# EAGLE board galvanika-board-2.2 (EAGLE 9.4.2)
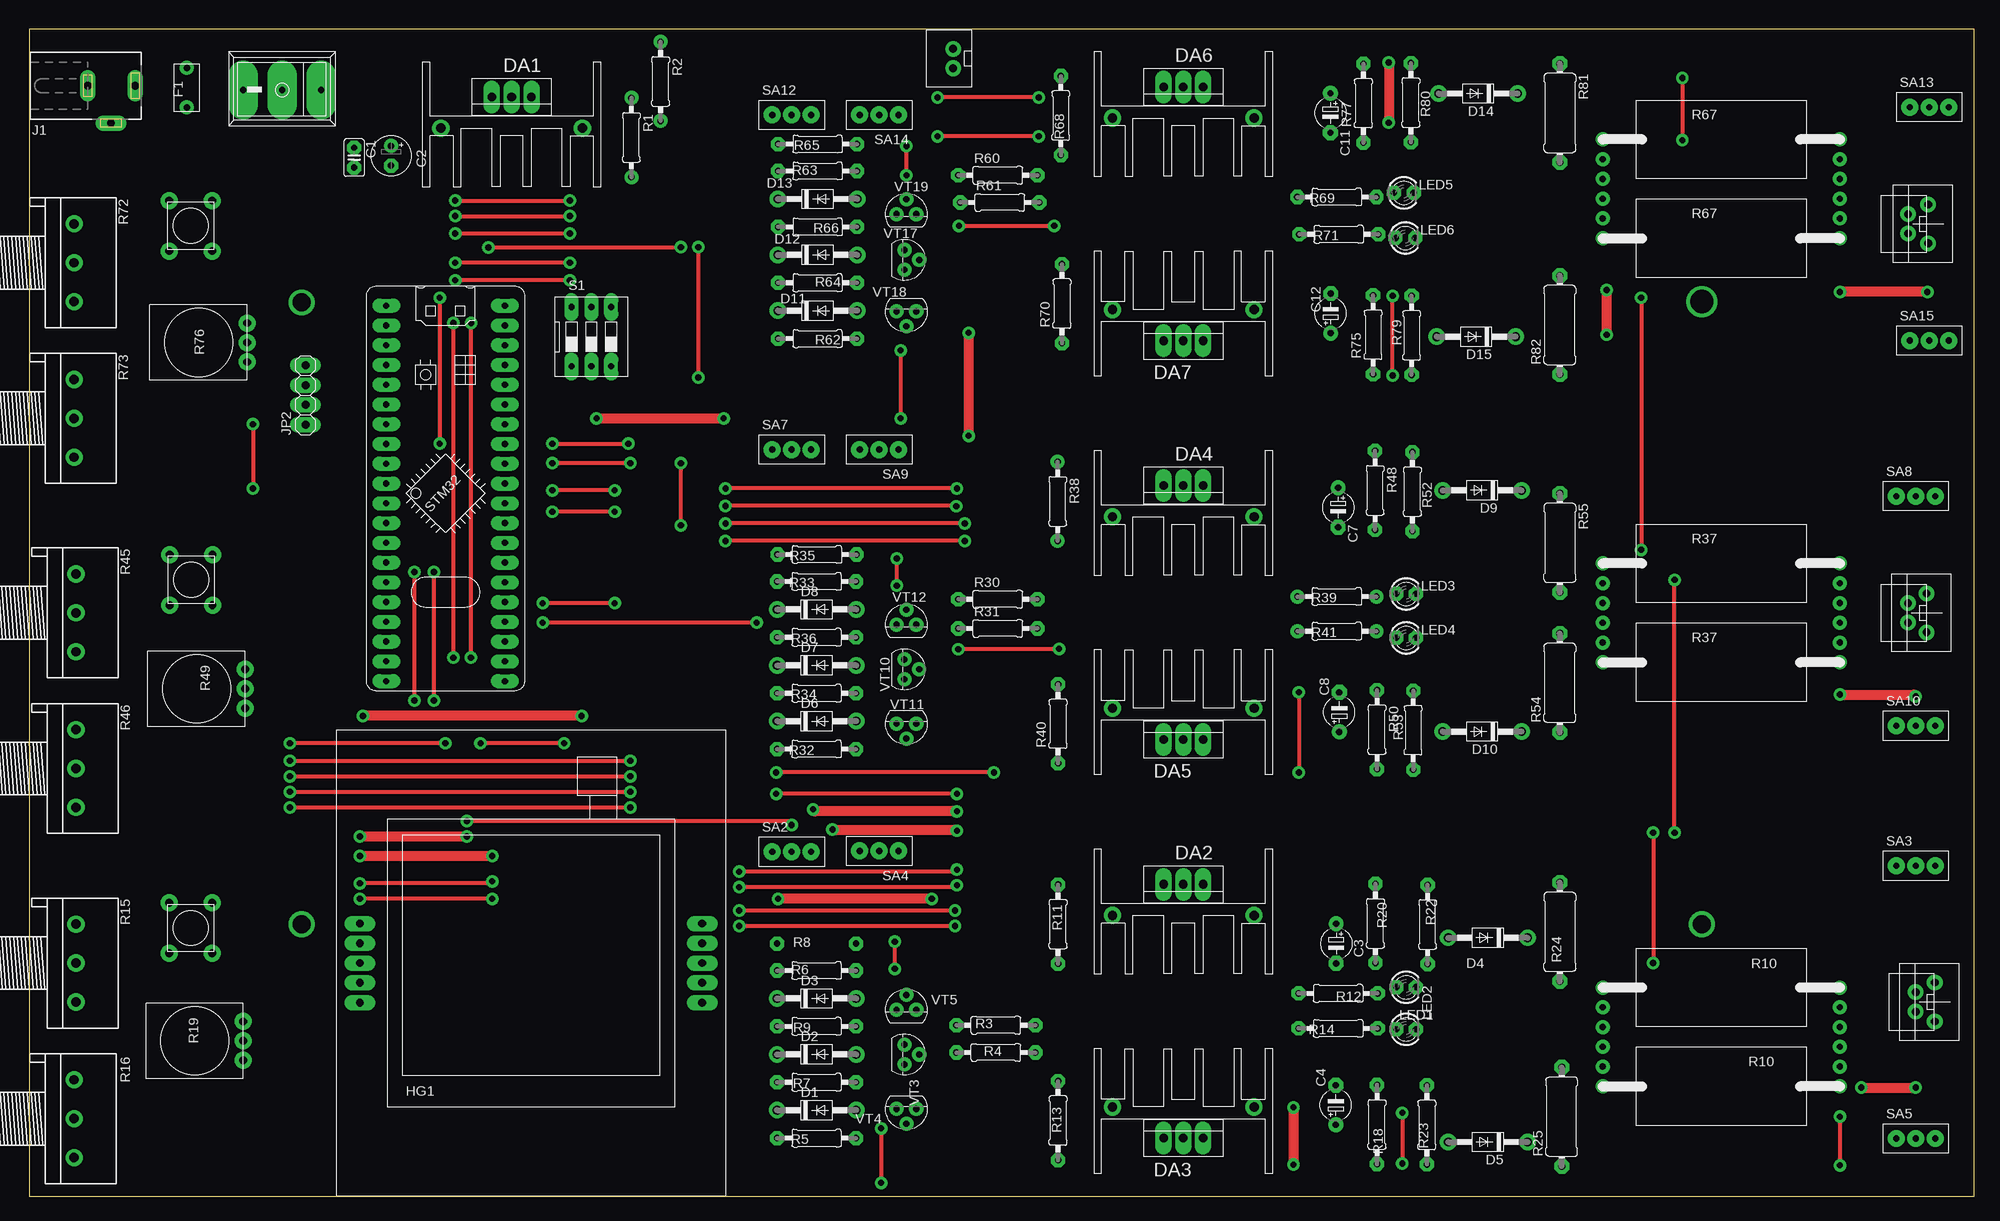
[diagram p2: board, top side]
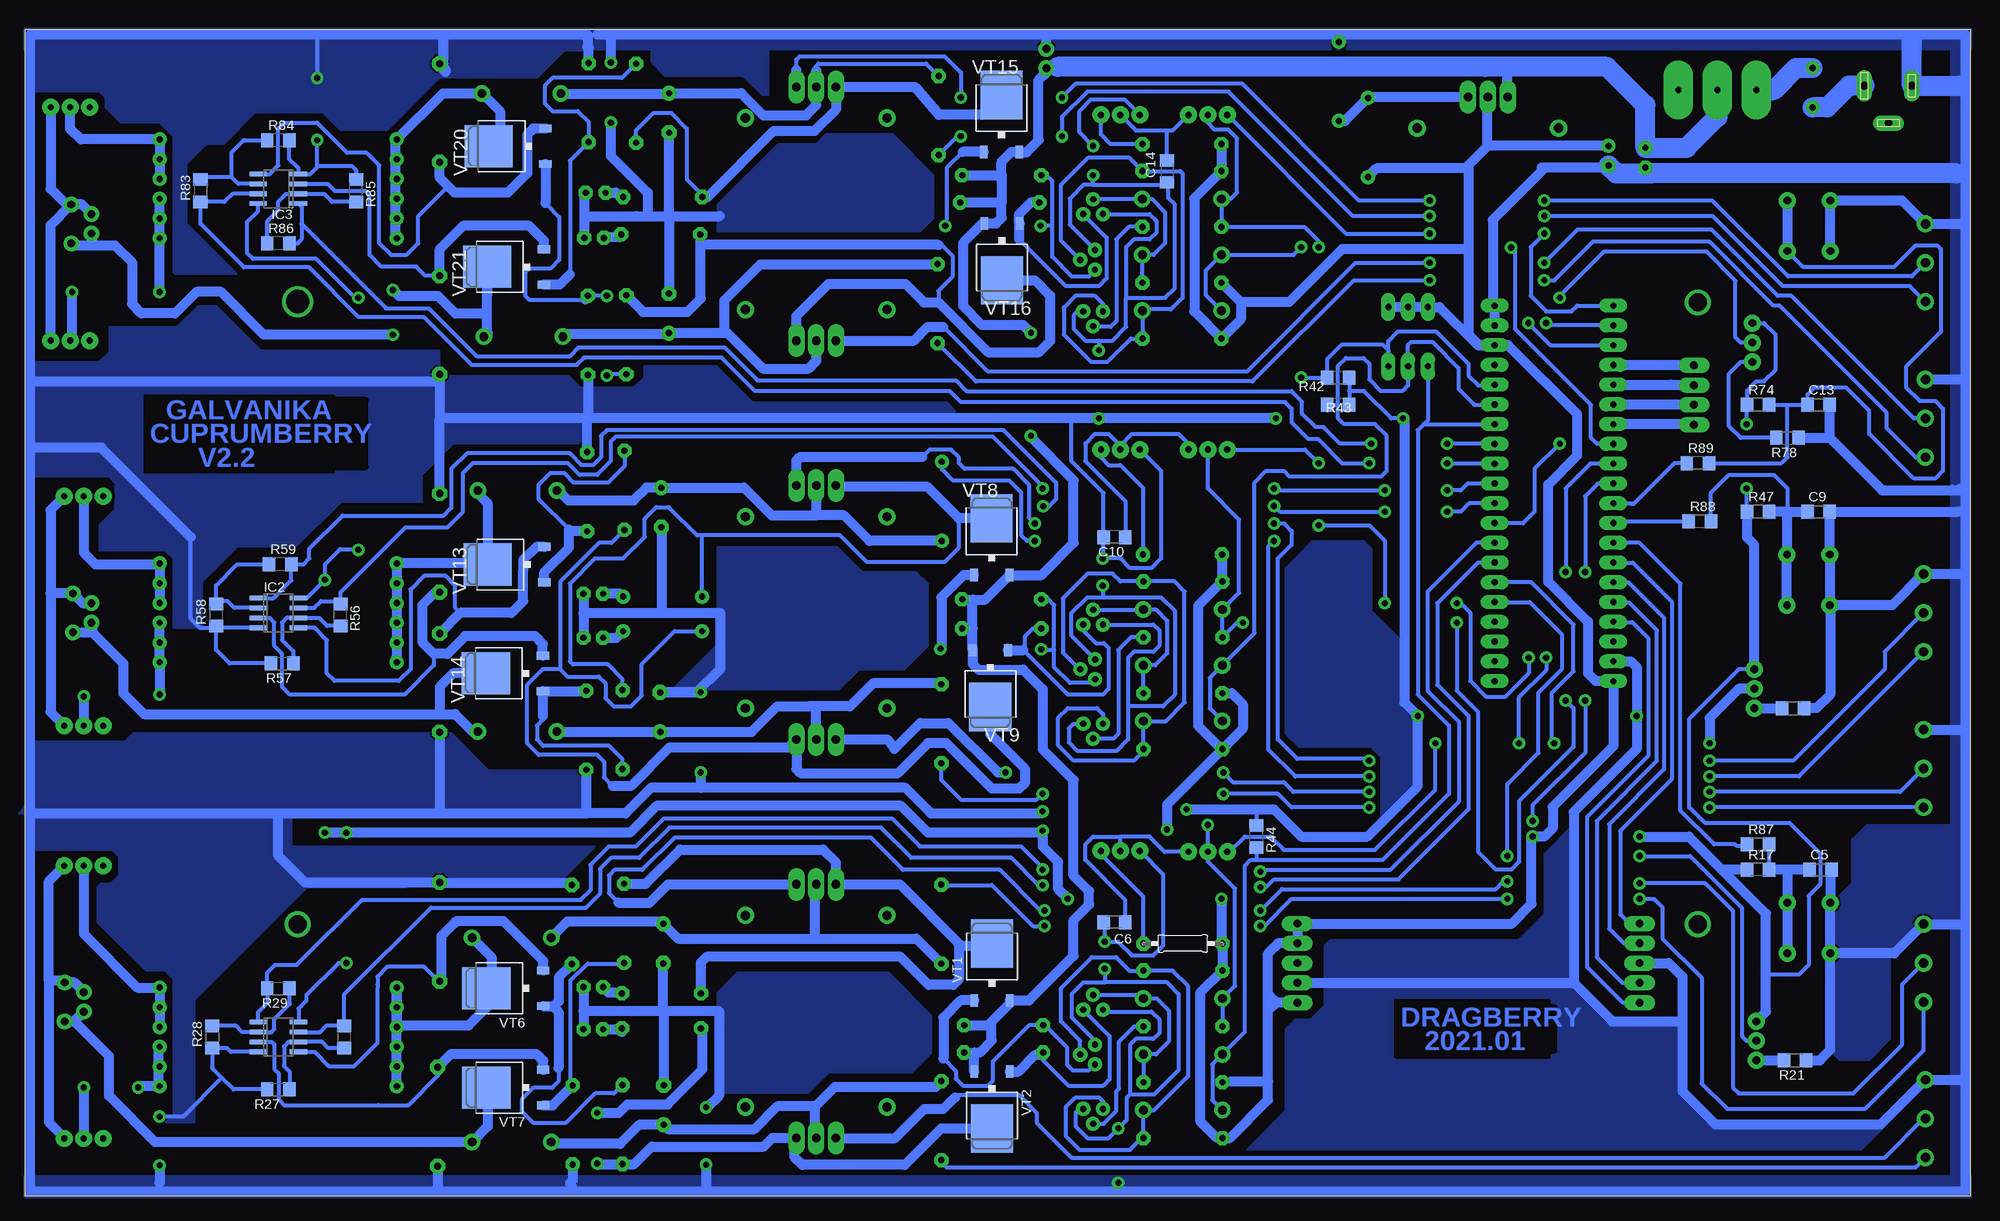
[diagram p3: board, bottom side, seen from below]

Size 250 x 150 mm. Coordinates in mm from the lower left corner, seen from the top.
Outline: 0,0 250,0 250,150 0,150 0,0
Copper layers (1*16): Top 0.035mm / dielectric 1.5mm / Bottom 0.035mm
Design rules "default *": minimum track width 6mil, minimum drill 0.8mm, track to track 15mil, track to pad 6mil, pad to pad 6mil, via to via 6mil, smd to smd 6mil, copper to edge 0mil, drill to drill 6mil, minimum pad ring 0.5mm, minimum via ring 8mil, stop-mask expansion 4mil, vias tented up to drill 0mil, thermal gap 10mil

## Footprints (pad centres in the part's own frame; a part is rotated, then mirrored left to right if it is on the bottom)
C025-025X050 = drill 0.813 octagon: 1 -1.27,0; 2 1.27,0
E2,5-5 = drill 0.813 pad 1.6: + -1.27,0 | drill 0.813 pad 1.6 octagon: - 1.27,0
E5-4 = drill 0.813 pad 1.905: + -2.54,0 | drill 0.813 pad 1.905 octagon: - 2.54,0
C1206 = smd 1.6 x 1.8: 1 -1.4,0; 2 1.4,0
DO41-10 = drill 1.118: A 5.08,0; C -5.08,0
TO220-23X16X40 = drill 1.118 long: 1 -2.54,0; 2 0,0; 3 2.54,0 | drill 1.2: P$1 -9.1,4; P$2 9.1,4
BLUE_PILL = drill 0.8 long: P$1 -7.62,15.24; P$2 -7.62,12.7; P$3 -7.62,10.16; P$4 -7.62,7.62; P$5 -7.62,5.08; P$6 -7.62,2.54; P$7 -7.62,0; P$8 -7.62,-2.54; P$9 -7.62,-5.08; P$10 -7.62,-7.62; P$11 -7.62,-10.16; P$12 -7.62,-12.7; P$13 -7.62,-15.24; P$14 -7.62,-17.78; P$15 -7.62,-20.32; P$16 -7.62,-22.86; P$17 -7.62,-25.4; P$18 -7.62,-27.94; P$19 -7.62,-30.48; P$20 -7.62,-33.02; P$21 7.62,15.24; P$22 7.62,12.7; P$23 7.62,10.16; P$24 7.62,7.62; P$25 7.62,5.08; P$26 7.62,2.54; P$27 7.62,0; P$28 7.62,-2.54; P$29 7.62,-5.08; P$30 7.62,-7.62; P$31 7.62,-10.16; P$32 7.62,-12.7; P$33 7.62,-15.24; P$34 7.62,-17.78; P$35 7.62,-20.32; P$36 7.62,-22.86; P$37 7.62,-25.4; P$38 7.62,-27.94; P$39 7.62,-30.48; P$40 7.62,-33.02
MF-R = drill 0.8 pad 1.676: 1 -2.54,0; 2 2.54,0
WD-G0906WY-BOARD = drill 1.016 pad 1.93 long: P$1 -22,5.08; P$2 -22,2.54; P$3 -22,0; P$4 -22,-2.54; P$5 -22,-5.08; P$6 22,-5.08; P$7 22,-2.54; P$8 22,0; P$9 22,2.54; P$10 22,5.08
SO08 = smd 0.6 x 2.2: 1 -1.905,-2.6; 2 -0.635,-2.6; 3 0.635,-2.6; 4 1.905,-2.6; 5 1.905,2.6; 6 0.635,2.6; 7 -0.635,2.6; 8 -1.905,2.6
DCJ0303 = drill 1 pad 2 long: 1 0,3.1; 2 4.8,0; 3 0,-3
1X04 = drill 1.016 long: 1 -3.81,0; 2 -1.27,0; 3 1.27,0; 4 3.81,0
LED3MM = drill 0.813 octagon: A -1.27,0; K 1.27,0
0207/10 = drill 0.8 pad 1.6: 1 -5.08,0; 2 5.08,0
0207/10' = drill 0.813 octagon: 1 -5.08,0; 2 5.08,0
SQP-5W-2 = drill 0.8 pad 1.778: 1 -15.24,6.35; 2 15.24,6.35; 3 -15.24,-6.35; 4 15.24,-6.35; P$1 -15.24,3.81; P$2 -15.24,1.27; P$3 -15.24,-1.27; P$4 -15.24,-3.81; P$5 15.24,3.81; P$6 15.24,1.27; P$7 15.24,-1.27; P$8 15.24,-3.81
3RP/1610N = drill 1.2 pad 2.184: 1 -5,0; 2 0,0; 3 5,0
R1206 = smd 1.6 x 1.803: 1 -1.422,0; 2 1.422,0
R0904N = drill 1 pad 2.184: 1 -2.5,0; 2 0,0; 3 2.5,0
0411/12 = drill 0.914 octagon: 1 -6.35,0; 2 6.35,0
DS-03 = drill 0.813 long: 1 -2.54,-3.81; 2 0,-3.81; 3 2.54,-3.81; 4 2.54,3.81; 5 0,3.81; 6 -2.54,3.81
KCD11-101-V = drill 0.8 pad 3.81 long: 1 0,0; 2 -5,0; 3 5,0
SS12D00 = drill 0.8 pad 2.184: 1$O -2.5,0; 1$P 0,0; 1$S 2.5,0
KLS7-6X6 = drill 1 pad 2.184: P$1 -3.25,2.75; P$2 3.25,2.75; P$3 -3.25,-2.75; P$4 3.25,-2.75
TO252 = smd 1 x 1.6: 1 -2.28,-4.8; 2 2.28,-4.8 | smd 5.4 x 6.2: 3 0,2.5
TO92 = drill 0.813 pad 1.676: 1 1.27,0; 2 0,1.905; 3 -1.27,0
CWF-2 = drill 1 pad 1.93: P$1 -1.25,0; P$2 1.25,0
KLS2-2 = drill 1 pad 1.778: 1 -2.5,0; 2 2.5,0

## Placement (x,y rotation side)
C1  2.2uF  [C025-025X050]  41.75,133.5 270 top
C2  0.1uF  [E2,5-5]  46.5,133.75 270 top
C3  1uF  [E5-4]  168,32.5 270 top
C4  1uF  [E5-4]  167.95,11.75 90 top
C5  1u  [C1206]  19.25,42 0 bottom
C6  0.1uF  [C1206]  110,35.25 180 bottom
C7  1uF  [E5-4]  168.25,88.55 270 top
C8  1uF  [E5-4]  168.4,62.25 90 top
C9  1u  [C1206]  19.5,88 0 bottom
C10  0.1uF  [C1206]  110,84.75 180 bottom
C11  1uF  [E5-4]  167.25,139.25 270 top
C12  1uF  [E5-4]  167.3,113.5 90 top
C13  1u  [C1206]  19.5,101.75 0 bottom
C14  0.1uF  [C1206]  103.25,131.75 270 bottom
D1  1N4001  [DO41-10]  101.2,11.09 0 top
D2  1N4001  [DO41-10]  101.2,18.27 0 top
D3  1N4001  [DO41-10]  101.2,25.45 0 top
D4  1N4001  [DO41-10]  187.5,33.25 180 top
D5  1N4001  [DO41-10]  187.5,7 180 top
D6  1N4001  [DO41-10]  101.2,61.09 0 top
D7  1N4001  [DO41-10]  101.2,68.27 0 top
D8  1N4001  [DO41-10]  101.2,75.45 0 top
D9  1N4001  [DO41-10]  186.75,90.75 180 top
D10  1N4001  [DO41-10]  186.75,59.75 180 top
D11  1N4001  [DO41-10]  101.33,113.84 0 top
D12  1N4001  [DO41-10]  101.33,121.02 0 top
D13  1N4001  [DO41-10]  101.33,128.2 0 top
D14  1N4001  [DO41-10]  186.25,141.75 180 top
D15  1N4001  [DO41-10]  186,110.5 180 top
DA1  LM338TO-220-23X16X40  [TO220-23X16X40]  62,141.3 180 top
DA2  LM338TO-220-23X16X40  [TO220-23X16X40]  148.35,40.12 180 top
DA3  LM338TO-220-23X16X40  [TO220-23X16X40]  148.35,7.5 0 top
DA4  LM338TO-220-23X16X40  [TO220-23X16X40]  148.35,91.36 180 top
DA5  LM338TO-220-23X16X40  [TO220-23X16X40]  148.35,58.74 0 top
DA6  LM338TO-220-23X16X40  [TO220-23X16X40]  148.35,142.6 180 top
DA7  LM338TO-220-23X16X40  [TO220-23X16X40]  148.35,109.98 0 top
DD1  [BLUE_PILL]  53.5,99.25 0 top
F1  1.85A  [MF-R]  20.25,142.5 90 top
HG1  WD-G0906WY-BOARD  [WD-G0906WY-BOARD]  64.5,30 0 top
IC1  LM358D  [SO08]  217.5,20.5 270 bottom
IC2  LM358D  [SO08]  217.5,75 270 bottom
IC3  LM358D  [SO08]  217.5,129.5 90 bottom
J1  [DCJ0303]  10.5,142.75 270 top
JP2  [1X04]  35.5,103 90 top
LED1  [LED3MM]  177,26.9 0 top
LED2  [LED3MM]  177,21.5 0 top
LED3  [LED3MM]  177,77.45 0 top
LED4  [LED3MM]  177,71.8 0 top
LED5  [LED3MM]  176.7,129 0 top
LED6  [LED3MM]  176.9,123.2 0 top
R1  [0207/10]  77.4,136.1 270 top
R2  [0207/10]  81.15,143.3 270 top
R3  3.3K  [0207/10']  124.25,22 0 top
R4  3.3K  [0207/10']  124.25,18.5 0 top
R5  680k  [0207/10']  101.2,7.5 180 top
R6  680K  [0207/10']  101.2,29.04 180 top
R7  680k  [0207/10']  101.2,14.68 180 top
R8  10K  [0207/10']  101.2,32.5 0 bottom
R9  10k  [0207/10']  101.2,21.86 180 top
R10  [SQP-5W-2]  217.5,20.5 0 top
R11  240  [0207/10']  132.25,35 270 top
R12  [0207/10']  168.25,26.1 180 top
R13  240  [0207/10']  132.25,9.75 90 top
R14  [0207/10']  168.25,21.6 180 top
R15  2k  [3RP/1610N]  6,30 270 top
R16  2k  [3RP/1610N]  5.75,10 270 top
R17  4.7k  [R1206]  27.25,42 0 bottom
R18  330  [0207/10']  173.25,9.25 270 top
R19  [R0904N]  27.5,20 90 top
R20  330  [0207/10']  173.05,35.1 270 top
R21  100  [R1206]  22.5,17.5 180 bottom
R22  3.3k  [0207/10']  179.75,34.95 270 top
R23  3.3k  [0207/10']  179.65,9.2 90 top
R24  0.1  [0411/12]  196.75,34 270 top
R25  0.1  [0411/12]  197,10.25 90 top
R26  100K  [R1206]  209,20.5 270 bottom
R27  10K  [R1206]  217.5,13.75 180 bottom
R28  10K  [R1206]  226,20.5 90 bottom
R29  100K  [R1206]  217.5,26.75 180 bottom
R30  3.3k  [0207/10']  124.5,76.75 0 top
R31  3.3k  [0207/10']  124.5,73 0 top
R32  680k  [0207/10']  101.2,57.5 180 top
R33  680K  [0207/10']  101.2,79.04 180 top
R34  680k  [0207/10']  101.2,64.68 180 top
R35  10K  [0207/10']  101.25,82.5 180 top
R36  10k  [0207/10']  101.2,71.86 180 top
R37  [SQP-5W-2]  217.5,75 0 top
R38  240  [0207/10]  132.2,89.33 270 top
R39  [0207/10]  168.08,77.1 180 top
R40  240  [0207/10']  132.25,60.75 90 top
R41  [0207/10]  168.08,72.65 180 top
R42  1k  [R1206]  81.25,105.25 180 bottom
R43  1k  [R1206]  81.25,101.75 180 bottom
R44  1k  [R1206]  91.75,46.25 270 bottom
R45  2k  [3RP/1610N]  6,75 270 top
R46  2k  [3RP/1610N]  6,55 270 top
R47  4.7k  [R1206]  27.25,88 0 bottom
R48  330  [0207/10']  173,90.75 270 top
R49  [R0904N]  27.75,65.25 90 top
R50  330  [0207/10']  173.25,60 270 top
R51  100  [R1206]  22.75,62.75 180 bottom
R52  3.3k  [0207/10']  177.8,90.58 270 top
R53  3.3k  [0207/10']  177.9,59.92 90 top
R54  0.1  [0411/12]  196.75,66 90 top
R55  0.1  [0411/12]  196.75,84 270 top
R56  100K  [R1206]  209.5,74.75 270 bottom
R57  10K  [R1206]  217,68.5 180 bottom
R58  10K  [R1206]  225.5,74.75 90 bottom
R59  100K  [R1206]  217.25,81.25 0 bottom
R60  3.3k  [0207/10']  124.5,131.25 0 top
R61  3.3k  [0207/10']  124.75,127.75 0 top
R62  680k  [0207/10']  101.33,110.25 180 top
R63  680K  [0207/10']  101.33,131.79 180 top
R64  680k  [0207/10']  101.33,117.43 180 top
R65  10K  [0207/10']  101.33,135.25 180 top
R66  10k  [0207/10']  101.33,124.61 180 top
R67  [SQP-5W-2]  217.5,129.5 0 top
R68  240  [0207/10']  132.6,138.92 90 top
R69  [0207/10']  168.08,128.45 180 top
R70  240  [0207/10']  132.75,114.75 90 top
R71  [0207/10']  168.33,123.65 180 top
R72  2k  [3RP/1610N]  5.75,120 270 top
R73  2k  [3RP/1610N]  5.75,100 270 top
R74  4.7k  [R1206]  27.25,101.75 0 bottom
R75  330  [0207/10']  172.75,110.75 90 top
R76  [R0904N]  28,109.75 90 top
R77  330  [0207/10']  171.5,140.5 90 top
R78  100  [R1206]  23.5,97.5 180 bottom
R79  3.3k  [0207/10']  177.7,110.67 90 top
R80  51k  [0207/10']  177.6,140.58 270 top
R81  0.1  [0411/12]  196.75,139.25 270 top
R82  3.3k  [0411/12]  196.75,112 90 top
R83  100K  [R1206]  227.5,129.25 90 bottom
R84  10K  [R1206]  217.5,135.75 0 bottom
R85  10K  [R1206]  207.5,129.25 270 bottom
R86  100K  [R1206]  217.5,122.5 0 bottom
R87  510  [R1206]  27.25,45.25 0 bottom
R88  510  [R1206]  34.75,86.75 0 bottom
R89  510  [R1206]  35,94.25 0 bottom
S1  [DS-03]  72.25,110.5 0 top
SA1  KCD11-101V  [KCD11-101-V]  32.5,142.2 180 top
SA2  [SS12D00]  98,44.3 0 top
SA3  [SS12D00]  242.5,42.5 0 top
SA4  [SS12D00]  109.25,44.4 180 top
SA5  [SS12D00]  242.5,7.45 0 top
SA6  KLS7-6X6  [KLS7-6X6]  20.75,34.5 270 top
SA7  [SS12D00]  98,96 0 top
SA8  [SS12D00]  242.5,90 0 top
SA9  [SS12D00]  109.25,96 180 top
SA10  [SS12D00]  242.5,60.5 0 top
SA11  KLS7-6X6  [KLS7-6X6]  20.8,79.25 270 top
SA12  [SS12D00]  98,139 0 top
SA13  [SS12D00]  244.25,140 0 top
SA14  [SS12D00]  109.25,139 180 top
SA15  [SS12D00]  244.25,110 0 top
SA16  KLS7-6X6  [KLS7-6X6]  20.75,124.75 270 top
VT1  AOD403  [TO252]  125.75,30 0 bottom
VT2  AOD403  [TO252]  125.75,11.25 180 bottom
VT3  2N2222  [TO92]  112.5,18.25 270 top
VT4  2N2222  [TO92]  112.75,11.25 180 top
VT5  2N2222  [TO92]  112.75,24 0 top
VT6  LR2905  [TO252]  188.25,26.75 90 bottom
VT7  LR2905  [TO252]  188.25,14 90 bottom
VT8  AOD403  [TO252]  125.78,84.65 0 bottom
VT9  AOD403  [TO252]  125.97,65.4 180 bottom
VT10  2N2222  [TO92]  112.48,67.75 270 top
VT11  2N2222  [TO92]  112.75,60.75 180 top
VT12  2N2222  [TO92]  112.75,73.5 0 top
VT13  LR2905  [TO252]  188.1,81.22 90 bottom
VT14  LR2905  [TO252]  188.3,67.22 90 bottom
VT15  AOD403  [TO252]  124.53,139.05 0 bottom
VT16  AOD403  [TO252]  124.47,120.25 180 bottom
VT17  2N2222  [TO92]  112.5,120.37 270 top
VT18  2N2222  [TO92]  112.75,113.75 180 top
VT19  2N2222  [TO92]  112.75,126.25 0 top
VT20  LR2905  [TO252]  187.95,134.97 90 bottom
VT21  LR2905  [TO252]  188.15,119.47 90 bottom
XS1  CWF-2  [CWF-2]  242.5,25 90 top
XS2  KLS2-2  [KLS2-2]  244.95,25 90 top
XS3  CWF-2  [CWF-2]  241.5,75 90 top
XS4  KLS2-2  [KLS2-2]  243.9,75 90 top
XS5  CWF-2  [CWF-2]  241.5,125 90 top
XS6  KLS2-2  [KLS2-2]  244.1,125 90 top
XS7  CWF-2  [CWF-2]  118.75,146.25 90 top

## Tracks (layer width: path | path; a pad name or v marks a point on that pad's centre or on a via)
+12V  (via drill 0.8 pad 1.6)
  Top 1.27: v120.75,111 v120.75,97.75
  Bottom 0.508: 127.31,18.5 R4.2
  Bottom 1.27: 125.78,22.47 126.25,22 R3.2 | 125.78,22.47 123.47,24.78 VT1.2 120.97,25.2 115.25,30.92 115.25,35.5 113.25,37.5 113.25,39.25 115.25,41.25 115.25,53.5 119.25,57.5 119.25,65.2 121.75,67.7 127.5,67.7 128.25,68.45 VT9.2 | VT2.2 128.03,18.5 | 125.78,22.47 125.78,20.03 127.31,18.5 | R4.2 128.03,18.5 | DA1.3 59.56,145.59 59.48,145.66 62.38,145.18 | 128.25,76.72 126.63,76.72 VT8.2 119.4,79.85 115.25,84 115.25,92.05 120.75,97.55 v120.75,97.75 | R31.2 129.55,72.97 128.25,72.97 | 129.33,76.5 R30.2 129.55,76.72 128.25,76.72 | 128.25,72.97 128.25,76.72 | 128.03,18.5 127.5,18.5 | VT9.2 128.25,70.45 | 117.32,145.18 118.07,145.18 118.75,144.5 | 124.5,131.25 124.5,133 123.25,134.25 VT15.2 122.2,134.2 121.3,134.2 119.75,135.75 119.75,143.5 118.75,144.5 | 124.5,131.25 124.5,127.75 | 124.5,127.75 124.5,125.75 125.2,125.05 VT16.2 126.95,125.05 129.45,122.55 129.45,114.45 127,112 121.75,112 v120.75,111 | R61.2 124.5,127.75 | R60.2 124.5,131.25 | VT9.2 128.25,72.97 | XS7.P$1 118.75,144.5
  Bottom 2.54: 117.32,145.18 62.38,145.18 46.68,145.18 41.75,140.25 C1.1 36.48,134.77 32.5,138.75 SA1.1
A-LEFT
  Bottom 0.508: R25.2 197,15.5 200.75,11.75 204.62,11.75 216.75,11.75 217.47,12.47 217.47,15.82 218,16.35 218,19.5 218.37,19.86 IC1.3
  Bottom 1.27: VT7.2 183.45,17.45 184.25,18.25 195.35,18.25 R25.2
A-LEFT1
  Bottom 0.508: 197.5,69.75 197.5,68.25 201.25,64.5 216,64.5 217,65.5 217,69.75 218,70.75 218,73.75 218.62,74.36 IC2.3
  Bottom 1.27: R55.2 197.35,77.65 199,76 199,71.25 197.5,69.75 195.75,69.75 193.5,72 184.5,72 183.5,71 VT14.2
A-LEFT2
  Bottom 0.508: IC3.3 211.13,130.13 210.24,129.25 206.25,129.25 205.75,128.75 205.75,121 204.25,119.5 199.75,119.5 198.6,118.35 R82.2
  Bottom 1.27: VT21.2 183.35,122.85 185.25,124.75 193.75,124.75 196.75,121.75 R82.2
A-RIGHT
  Bottom 0.508: R24.2 196.9,27.65 198.75,29.5 203.5,29.5 204.75,28.25 204.75,27.25 204.75,26.75 204.75,19.75 207.75,16.75 211,16.75 212.84,18.59 IC1.5
  Bottom 1.27: VT6.2 183.45,30.28 188.59,35.41 194.55,35.41 194.85,35.11 194.89,35.11 196.5,33.5 196.5,27.9 R24.2
A-RIGHT1
  Bottom 0.508: 186,80.5 186,80.75 | 194.1,75 194.75,75.65 194.75,78.5 196,79.75 198.75,79.75 200.5,78 200.5,67.75 202,66.25 210.25,66.25 211.25,67.25 211.25,71.5 212.84,73.09 IC2.5
  Bottom 1.27: VT13.2 184.3,83.5 186,81.8 186,80.75 | R54.2 194.1,75 187.5,75 186,76.5 186,80.5
A-RIGHT2
  Bottom 0.508: IC3.5 218.59,131.41 217.5,132.5 217.5,137.25 216.75,138 212.5,138 208.62,134.12 206.12,134.12 204.5,132.5 204.5,122.5 203,121 201,121 199.5,122.5 199.5,126 195.8,129.7 195.55,129.7
  Bottom 1.27: VT20.2 184.75,137.25 185.5,136.5 185.5,131.5 188,129 194.85,129 195.55,129.7 196.75,130.9 R81.2
ADC0  (via drill 0.8 pad 1.6)
  Top 1.27: v59.5,43.75 v42.5,43.75
  Bottom 0.508: DD1.P$36 56.62,76.39 52.5,72.27 52.5,67.75 55.5,64.75 55.5,57 59.5,53 v59.5,43.75 | v42.5,43.75 36,43.75 29.35,37.1 29.35,20.6 28.75,20 R19.2
ADC1  (via drill 0.8 pad 1.6)
  Top 0.508: v53.5,58.25 v33.5,58.25
  Bottom 0.508: v53.5,58.25 53.75,58.5 53.75,64.75 51,67.5 51,73.5 56.43,78.93 DD1.P$35
  Bottom 1.27: R49.2 29.75,65.25 33.5,61.5 v33.5,58.25
ADC2  (via drill 0.8 pad 1.6)
  Top 0.508: v119.25,40 119,39.75 v91.25,39.75
  Bottom 0.508: v119.25,40 119.75,40 123.27,43.52 136.1,43.52 139.98,47.4 167.22,47.4 171.1,43.52 174.73,43.52 176.15,42.1 176.15,38.9 177.93,37.13 197.87,37.13 209,26 R26.1 209.08,22 211.25,22 212.12,21.14 IC1.7 | v91.25,39.75 90.5,39.75 89.5,40.75 73.5,40.75 64.5,49.75 64.5,61.75 68.5,65.75 68.5,76.25 63.25,81.5 61.15,81.5 DD1.P$34
ADC3  (via drill 0.8 pad 1.6)
  Top 0.508: v119.25,42 119,41.75 v91.25,41.75
  Bottom 0.508: v119.25,42 119.25,42.25 122,45 135,45 138.6,48.6 167.9,48.6 171.5,45 175,45 177.38,42.62 177.38,39.38 178.62,38.12 206.72,38.12 215.1,29.75 217.92,29.75 218.92,28.75 R29.2 218.92,24.83 220.1,23.66 IC1.1 | v91.25,41.75 91,42 74.5,42 65.75,50.75 65.75,61 69.75,65 69.75,77.75 63.49,84.01 DD1.P$33
ADC4  (via drill 0.8 pad 1.6)
  Top 0.508: v52.75,115.5 v52.75,96.75
  Bottom 0.508: v52.75,115.5 52.75,115.75 47.05,121.45 33.95,121.45 30.18,117.67 30.18,110.42 29.5,109.75 R76.2 | v52.75,96.75 56,93.5 56,88 57.5,86.5 61.07,86.5 DD1.P$32
ADC5  (via drill 0.8 pad 1.6)
  Top 0.508: v75.25,88 v67.25,88 | v119.16,88.71 119.12,88.75 v89.5,88.75
  Bottom 0.508: DD1.P$31 64.41,89.09 65.5,88 v67.25,88 | IC2.1 218.09,76.91 215.83,79.17 R59.2 214.25,81.25 213.5,82 213.5,83.25 209.25,87.5 196.25,87.5 195.25,88.5 195.25,93.5 193.25,95.5 180,95.5 178.5,94 177,94 176,95 176,97.75 175.25,98.5 124.25,98.5 117.5,91.75 117.5,89.62 118.41,88.71 v119.16,88.71 | v89.5,88.75 88.75,88 v75.25,88
ADC6  (via drill 0.8 pad 1.6)
  Top 0.508: v75.25,90.75 v67.25,90.75 | v119.25,91 v89.5,91
  Bottom 0.508: DD1.P$30 64.62,91.63 65.5,90.75 v67.25,90.75 | IC2.7 212.87,75.64 212,76.5 209.83,76.5 R56.1 209.5,77.65 201.15,86 195.75,86 193.75,88 193.75,93 192.5,94.25 180.25,94.25 178.75,92.75 176.5,92.75 174.75,94.5 174.75,97 174.14,97.61 125.61,97.61 119.25,91.25 v119.25,91 | v89.5,91 89.25,90.75 v75.25,90.75
ADC7  (via drill 0.8 pad 1.6)
  Top 0.508: v77.25,94.25 v67.25,94.25
  Bottom 0.508: DD1.P$29 61.2,94.25 v67.25,94.25 | v77.25,94.25 80.75,94.25 83.88,97.38 85.12,97.38 87.25,99.5 87.25,101.25 88.09,102.09 129.75,102.09 131.16,103.5 156.2,103.5 160.5,107.8 178.2,107.8 179.13,106.87 192.63,106.87 198.76,113 207.15,113 213.55,119.4 221.9,119.4 227.5,125 R83.1 224.42,127.83 223.38,128.87 IC3.7
ADC8  (via drill 0.8 pad 1.6)
  Top 0.508: v67.25,96.75 v77,96.75
  Bottom 0.508: DD1.P$28 67.21,96.71 v67.25,96.75 | v77,96.75 81,96.75 83.12,98.88 84.12,98.88 85.88,100.62 85.88,102.12 87.25,103.5 129,103.5 130.4,104.9 155.9,104.9 160.05,109.05 178.95,109.05 180,108 192,108 198.14,114.14 203.64,114.14 214.5,125 | R86.2 215,122.5 214.5,123 214.5,125 | 214.5,125 214.5,127.19 IC3.1
BRANCH-CTRL-A  (via drill 0.8 pad 1.6)
  Top 0.508: v49.5,80.25 v49.5,63.75 | v98,47.75 97.5,48.25 v56.25,48.25
  Bottom 0.508: R9.2 D3.C 94.5,27.07 94.5,39.55 98,43.05 SA2.1$P v98,47.75 | DD1.P$10 47.87,91.63 49.5,90 v49.5,80.25 | v56.25,48.25 56.25,50.25 49.5,57 v49.5,63.75
BRANCH-CTRL-B  (via drill 0.8 pad 1.6)
  Top 0.508: v52,80.25 v52,63.75 | v93.5,73.75 v66,73.75
  Bottom 0.508: SA7.1$P 98,91 94,87 94,77.57 D8.C R36.2 94.23,73.75 v93.5,73.75 | DD1.P$9 48.83,94.17 52,91 v52,80.25 | v52,63.75 51,62.75 51,57.79 58,50.79 58,43 59,42 61,42 63.25,44.25 63.25,62.25 66,65 v66,73.75
BRANCH-CTRL-C  (via drill 0.8 pad 1.6)
  Top 0.508: v83.75,122 83.71,121.96 v59,121.96
  Bottom 0.508: SA12.1$P 98,138 97.12,137.12 95.38,137.12 94.25,136 94.25,129 95.05,128.2 D13.C R66.2 85.61,124.61 83.75,122.75 v83.75,122 | v59,121.96 58.5,121.46 58.5,111.5 48.75,101.75 48.75,97.5 47.96,96.71 DD1.P$8
GND  (via drill 0.8 pad 1.6)
  Top 0.508: v232.75,10.25 v232.75,4 | v111.25,32.75 v111.25,29.25 | v109.5,8.75 v109.5,1.75 | v111.5,82 v111.5,78.5 | v163.2,64.8 v163.2,54.5 | v112,108.75 v112,100 | v112.75,131.25 v112.75,135 | v212.5,143.75 v212.5,135.75
  Top 1.27: v119.25,49.5 101,49.5 v100.75,49.75 | v71,61.75 v42.88,61.75 | v72.91,100 v89.25,100 | v174.75,145.75 v174.75,138 | v162.5,11.45 v162.5,4.08
  Bottom 0.508: VT3.3 112.5,20.02 115.5,23.02 115.5,26 114,27.5 111.25,27.5 | 111.25,27.5 103.25,27.5 101.75,26 101.75,16.25 104.88,13.12 108,13.12 | 108,13.12 108.02,13.12 108.44,12.7 108.44,9.8 v109.5,8.75 110.75,7.5 113.5,7.5 115,9 115,10.77 114.52,11.25 VT4.3 | VT5.3 111.23,23.75 105.25,23.75 104.25,22.75 104.25,21 105,20.25 107.25,20.25 108,19.5 108,13.12 | 1,15 0.64,15 | 179.75,1.25 179.75,1 | 179.75,1 179.75,0.64 | v232.75,10.25 229.75,10.25 224.75,15.25 | 232.75,1.75 232.75,0.64 | SA4.1$S 103.75,41.4 103.75,32.25 105,31 107.77,31 109.52,32.75 v111.25,32.75 111.25,35.1 C6.2 | v111.25,29.25 111.25,27.5 | 180,1.75 180,1.25 179.75,1 | 2.25,91.25 2,91 1.25,91 0.64,91 | 1.5,88 0.89,88 0.64,87.75 | 91.75,49.75 R44.1 | VT12.3 105,73.5 104.25,72.75 104.25,70.75 105,70 107.5,70 108.25,69.25 108.25,63 | 108.25,63 108.25,58.75 109.75,57.25 114.75,57.25 115.88,58.38 115.88,60.15 115.27,60.75 VT11.3 | VT10.3 115.5,72.04 115.5,75 113.5,77 111.5,77 | 108.25,63 103.75,63 102.25,64.5 102.25,75.25 104,77 111.5,77 | v111.5,78.5 111.5,77 | SA9.1$S 104,93.25 104,82 105.25,80.75 108,80.75 109.25,82 v111.5,82 111.5,84.65 C10.2 111.4,90.4 115.5,94.5 115.5,100 | 228.75,84.75 228.75,74.25 227.59,73.09 225.73,73.09 | R57.2 223.75,68.5 225.5,70.25 225.5,73.09 225.27,73.09 | IC2.4 225.27,73.09 | 225.27,73.09 R58.1 225.73,73.09 | 225.73,73.09 225.52,73.09 | R42.1 79.83,103.5 | 79.83,103.5 R43.1 | v72.91,100 74.41,100 77.91,103.5 79.83,103.5 | VT18.3 114.75,113.75 115.25,113.25 115.25,111.5 113.75,110 112,110 | 112,110 110.25,110 108.5,111.75 108.5,115.5 | 108.5,115.5 103.5,115.5 102.25,116.75 102.25,127.5 103.12,128.38 103.12,130.22 C14.2 103.6,130 112.75,130
  Bottom 0.508: 112.75,130 114,130 115.75,128.25 115.75,124.89 VT17.3 | VT19.3 105.5,126.25 104.62,125.38 104.62,123.88 105.5,123 107.5,123 108.5,122 108.5,115.5 | 112,110 v112,108.75 | 112.75,130 v112.75,131.25 | v112.75,135 114.5,136.75 114.5,139.5 113,141 108.75,141 SA14.1$S | 173.5,126 171.48,126 | 212.4,132.41 213.4,131.41 IC3.4 214.9,132.15 216.08,133.33 R84.2 | 212.4,132.41 208,132.41 207.5,131.91 R85.1 | 212.4,132.41 212.5,132.5 v212.5,135.75 | 212.5,149.37 v212.5,143.75 | 224.75,15.25 226,16.5 R28.1 224.08,19.08 223.59,18.59 IC1.4 | R27.2 223.25,13.75 224.75,15.25
  Bottom 1.27: 109.5,0.64 0.64,0.64 0.64,15 0.64,35 | 109.5,0.64 162.5,0.64 | 162.5,0.64 179.75,0.64 197,0.64 | 197,0.64 232.75,0.64 249.37,0.64 | 249.37,0.64 249.5,0.64 | 249.37,0.64 249.37,49.25 | 249.37,49.25 249.37,96.25 | 249.37,96.25 249.37,104.75 | 249.37,104.75 249.37,149.37 212.5,149.37 196.25,149.37 | 196.25,149.37 177.75,149.37 177.75,147.76 177.6,147.61 R80.1 | 176.5,149.37 174.75,149.37 | 174.75,149.37 118.75,149.37 | 118.75,149.37 0.64,149.37 0.64,142.75 | 0.64,142.75 0.64,131.48 | 0.64,125 0.64,105 | 0.64,105 0.64,91 0.64,87.75 0.64,80.25 | 0.64,80.25 0.64,60 | 0.64,60 0.64,35 | 1.25,142.75 0.64,142.75 | 178.25,23.85 168,23.85 | HG1.P$3 38.75,30 37,28.25 37,22.5 | HG1.P$7 50.96,27.46 | 50.96,27.46 46,22.5 37,22.5 | DD1.P$19 43.63,68.77 42.88,68.02 v42.88,61.75 42.88,57.52 50.96,49.44 50.96,27.46 | R25.1 197,0.64 | 1,15 R16.1 11.5,9.25 32.75,9.25 37,13.5 37,22.5 | 0.64,35 R15.1 9.75,31.25 SA6.P$4 | 179.85,1.35 179.75,1.25 | SA11.P$4 SA11.P$3 18.1,82.55 C9.2 1.5,88 | SA16.P$4 SA16.P$3 8.75,128 R72.1 0.64,125 | v109.5,1.75 109.5,0.64 | 249.37,49.25 217.5,49.25 | 217.5,49.25 196.75,49.25 | 196.75,49.25 177.9,49.25 | SA6.P$4 SA6.P$3 18,41.85 C5.2 | R21.1 19.33,17.5 18,18.83 SA6.P$4 | SA11.P$4 10,76 R45.1 0.89,80 0.64,80.25 | SA11.P$4 18,75.95 18,64.5 19.75,62.75 R51.1 | R73.1 0.64,105 | DD1.P$22 DD1.P$21 61.37,114.74 61.37,125.5 54.87,132 55.1,132.23 47.5,132.23 47.25,132.48 C2.- | 41,131.48 C1.2 42.25,131.73 | 0.64,131.48 1.75,131.48 | v100.75,49.75 91.75,49.75 89.5,49.75 86,46.25 77.5,46.25 71,52.75 v71,61.75 72.75,63.5 72.75,99.84 v72.91,100 | R46.1 0.64,60 | LED3.K 178.27,74.96 178.23,75 | 178.23,75 178.27,74.95 LED4.K
  Bottom 1.27: 178.23,75 168.25,75 | 168.25,75 160.7,75 160.7,67.79 163.7,64.79 C8.- v163.21,64.79 v163.2,64.8 | 249.37,104.75 196.75,104.75 196.75,100 | R54.1 196.75,49.25 | R55.1 196.75,100 | v89.25,100 v112,100 115.5,100 177.7,100 R79.1 | R53.1 177.9,49.25 | R52.1 177.8,100 196.75,100 | v119.25,49.5 119.5,49.25 133.6,49.25 136.85,52.5 163.2,52.5 | v163.2,54.5 163.2,52.5 | LED6.K 178.17,128.8 LED5.K | 167.25,126 C11.- | 177.83,126 171.48,126 170,126 | 170,126 167.25,126 | 174.75,149.37 v174.75,145.75 | 249.37,96.25 240.25,96.25 228.75,84.75 | 0.64,131.48 0.64,125 | XS7.P$2 118.75,149.37 | R23.1 179.65,2.1 180,1.75 | v232.75,4 232.75,1.75 | LED1.K LED2.K | 167.95,23.85 C4.- | R22.1 180.07,40.35 R24.1 214.05,40.35 217.5,43.8 217.5,49.25 | 168,23.85 C3.- | v162.5,11.45 162.3,11.45 160.85,12.9 160.85,23.85 167.95,23.85 | v162.5,4.08 162.5,0.64 | 168,23.85 167.95,23.85 | C7.- 168.25,75 | R81.1 196,144.85 196,144.5 196.25,144.75 196.25,149.37 | 170,126 170,129 174.75,133.75 v174.75,138 | C12.- 167.25,116.09 167.25,126 | 167.25,126 160.75,126 | R78.1 18.08,97.5 | 18.08,97.5 11.33,90.75 1.5,90.75 1.25,91 | C13.2 18.1,97.52 18.08,97.5 | 163.2,52.5 169.58,52.5 172.83,49.25 177.9,49.25
  Bottom 2.54: 1.27,142.75 J1.3 7.5,148.73 | 1.75,131.48 41,131.48 45.5,131.48 C2.-
  pour Bottom: 0,0 0,2 0,2.5 250,2.5 250,0
  pour Bottom: 0,150 0,147.5 250,147.5 250,150
  pour Bottom: 178,97.5 178.25,97.5 179,96.75 195,96.75 199,92.75 199,89.25 209.5,89.25 215.25,83.5 222.75,83.5 227.25,79 227.25,73.25 227.5,73 231,73 231,82 232,83 240.5,83 240.5,86.25 238.5,88.25 238.5,91.25 238.25,91.5 239.25,92.5 249.5,92.5 249.5,107.5 249.25,107.25 240.5,107.25 239.25,108.5 239.25,111.75 230.5,111.75 227.75,114.5 225.5,114.5 219.75,108.75 196.75,108.75 196.75,103.75 193.25,100.25 178,100.25
  pour Bottom: 11,9 14,6 93,6 88,11 88,21.5 86.75,22.75 84.75,22.75 83,24.5 83,32.25 82.25,33 58,33 54.75,36.25 54.75,44 51,47.75 51,27.75 46.25,23 46.25,22.25 46,22.5 37.25,22.5 37,22.25 37,13.75 33,9.75 33,9.5 32.75,9.25 11,9.25
  pour Bottom: 72.5,70.75 77,75.25 77,83.25 78,84.25 84.5,84.25 88,80.75 88,59.5 86.25,57.75 77,57.75 75.75,56.5 75.75,48.25 71.5,52.5 71.25,52.5 71,52.75 71,62 72.5,63.5
  pour Bottom: 176.75,45 181.5,40.25 200.5,40.25 201.05,39.7 213.85,39.7 228.25,25.3 228.25,9.5 232,9.5 231,10.5 231,28 232,29 234.5,29 240.75,35.25 240.75,39.75 240.25,40.25 239,40.25 238,41.25 238,43.75 238.75,44.5 248.75,44.5 248.75,53 215.75,53 215.75,45
  cutout Bottom: 210.25,103 234.75,103 234.75,93 210.25,93
  cutout Bottom: 54,25.25 74,25.25 74,18 73.75,17.75 54,17.75 54,25
  pour Bottom: 0,150 2.5,150 2.5,0 0,0
  pour Bottom: 1.25,47.75 13.25,47.75 15,46 15.25,46 15.25,40.25 17.75,37.75 18,37.75 18.25,37.5 18.25,19 16.75,17.5 13,17.5 10.25,20.25 10.25,30.75 6.25,34.75 1.25,34.75
  pour Bottom: 177.5,147.25 180.75,147.25 184.25,143.75 196.75,143.75 203.5,137 209.5,137 211.75,139.25 220.5,139.25 224.5,135.25 226.75,135.25 229.25,132.75 229.25,125 222.75,118.5 230.75,118.5 231,118.75 231,136.25 232.75,138 237.75,138 239.75,140 239.75,141.25 240.5,142 249.5,142 249.5,149.25 154.5,149.25 154.5,141.5 155.25,141.5 157.75,144 167.75,144 169.5,145.75 169.5,148 177,148 177.5,147.5
  pour Bottom: 196.75,105.5 180.25,105.5 178.75,104 171.75,104 170.5,105.25 170.5,106.75 161.2,106.75 156.5,102.05 131.55,102.05 130.5,101 130.5,100 130.75,99.75 194.25,99.75 196.75,102.25
  pour Bottom: 161,127.5 153.2,135.3 148.3,135.3 147.05,136.55 138.55,136.55 133.25,131.25 133.25,125.75 135,124 161,124
  pour Bottom: 161,83.5 145.65,83.5 142.45,80.3 135.55,80.3 134,78.75 134,70.75 137.05,67.7 142.85,67.7 145.45,65.1 166.9,65.1 161,71
  pour Bottom: 161.05,13.25 149.4,13.25 146.75,15.9 136.1,15.9 133.5,18.5 133.5,23.25 139.05,28.8 158.45,28.8 161.05,26.2
  pour Bottom: 177.8,54.8 190.5,54.8 195.3,59.6 236.1,59.6 237.2,58.5 249.3,58.5 249.4,58.6 249.4,50.7 250.9,49.2 177.8,49.2
MODE-CTRL-A
  Bottom 0.508: 45.5,84 42.5,84 37.25,78.75 37.25,49.6 32.9,45.25 30.25,45.25 30.08,45.08 28.84,45.08 R87.1 | 45.5,84 45.85,84 | DD1.P$13 45.51,84.01 45.5,84
MODE-CTRL-B
  Bottom 0.508: 44.75,86.75 45.64,86.75 | DD1.P$12 44.95,86.55 44.75,86.75 | 44.75,86.75 R88.1
MODE-CTRL-C
  Bottom 0.508: DD1.P$11 45.79,89 43.5,89 43.25,89 38,94.25 R89.1
N$1
  Bottom 0.508: VT3.1 113.25,16.23 115.4,16.23 116.08,16.91 116.08,19.16 118.92,22 R3.1 121,22 125.62,17.38 125.62,14.88 126.25,14.25 129.5,14.25 130.38,15.12 130.38,16.12 132,17.75
  Bottom 1.27: VT1.1 129.78,25.2 132,22.98 132,17.75
N$2
  Bottom 0.508: DD1.P$15 43.93,78.93 39.36,74.36 39.36,54.89 46.39,47.86 46.39,34.4 46.38,34.41 44.5,32.54 HG1.P$2
N$3  (via drill 0.8 pad 1.6)
  Top 1.27: v235.5,14 v242.5,14
  Bottom 1.27: 232.9,19.15 232.9,14.31 R10.4 235.35,14.15 v235.5,14 | v242.5,14 SA5.1$P
N$4
  Bottom 1.27: DA1.1 77.52,141.3 R1.1 80.36,138.22 R2.2
N$5  (via drill 0.8 pad 1.6)
  Top 0.508: v132.38,70.38 132.33,70.33 v119.42,70.33
  Bottom 0.508: VT10.1 112.96,66 115.75,66 117.75,68 117.75,70.25 | 117.75,70.25 117.75,76 118.5,76.75 R30.1 | v119.42,70.33 119.34,70.25 117.75,70.25
  Bottom 1.27: VT8.1 129.4,79.85 132.25,77 132.25,70.5 v132.38,70.38
N$6
  Bottom 0.508: VT4.2 111.41,9.35 109.75,11 109.75,13.5 109.4,13.85 109.4,19.9 107.44,21.86 R9.1
N$7
  Bottom 0.508: VT3.2 114.41,20 116.91,22.5 116.91,26.75 112.91,30.75 109.78,30.75 108.07,29.04 R6.1 102.54,29.04 100.5,27 100.5,15.5 104.91,11.09 D1.A 106.28,7.72 | VT4.1 111.48,12.23 112,12.75 115,12.75 116.25,11.5 116.25,7.75 114.5,6 108,6 106.33,7.67 106.28,7.72 | R5.1 106.28,7.72
N$8
  Bottom 0.508: LED1.A 175.87,26.9 175.97,27
  Bottom 1.27: LED1.A 175.06,26.23 173.46,26.23 R12.1
N$9  (via drill 0.8 pad 1.6)
  Top 0.508: v59.5,38.25 v42.5,38.25 | v119,34.75 v91.25,34.75
  Bottom 0.508: R15.3 6,18.75 13.5,11.25 31.25,11.25 34.5,14.5 34.5,28.1 39.55,33.15 39.55,37.15 40.65,38.25 v42.5,38.25 | v119,34.75 120.5,34.75 125.75,40 132.17,40 R11.1 | v91.25,34.75 90.75,34.75 87.25,38.25 v59.5,38.25
N$10  (via drill 0.8 pad 1.6)
  Top 0.508: v59.5,40.5 59.25,40.25 v42.5,40.25 | v119,36.75 v91.25,36.75
  Bottom 0.508: v42.5,40.25 34.05,40.25 30.5,36.7 30.5,14 29.75,13.25 15,13.25 8.75,19.5 8.75,27.25 R15.2 | v91.25,36.75 88.5,39.5 61,39.5 60,40.5 v59.5,40.5 | v119,36.75 119.5,36.75 124.73,41.98 137.2,41.98 141.32,46.1 166.58,46.1 170.7,41.98 174.27,41.98 175,41.25 175,39 173.75,37.75
  Bottom 1.27: 173.75,37.75 169.78,37.74 167.4,40.12 DA2.1
N$11
  Bottom 0.508: DD1.P$14 43.38,81.47 38.36,76.45 38.36,53.63 45,46.99 45,36.25 43.83,35.08 HG1.P$1
N$12
  Bottom 0.508: R18.1 174.33,13.25 176.75,13.25 180.5,9.5 184.75,9.5 186.2,10.95 186.2,12.47 184.71,13.96 182.29,13.96 181.46,14.79 181.46,16.5 | 181.62,23.89 181.46,23.73
  Bottom 1.27: VT6.1 182.2,24.47 182.12,24.39 | 182.12,24.39 181.62,23.89 | 181.46,23.73 181.46,16.5 | 182.12,24.39 181.45,25.07 181.45,28.17 R22.2
N$13
  Bottom 1.27: R10.3 R10.1 202.26,22.35 201.91,22 193,22 190.75,24.25 VT6.3 190.08,27.42 190.08,30.75 D4.C
N$14
  Bottom 1.27: SA3.1$P 242.5,33.75 235.6,26.85 R10.2 232.75,21.75
N$15
  Bottom 0.508: 179.65,14 R23.2 179.95,14.58 179.95,27.7 177.73,29.92 173.15,29.92 R20.2
  Bottom 1.27: VT7.1 182.21,11.72 R23.2
N$16
  Bottom 0.508: VT5.2 106.74,25.91 D3.A 104.6,25.45 103,23.85 103,19.93 104.66,18.27 D2.A R7.1
N$17
  Bottom 0.508: R17.2 R87.2
  Bottom 1.27: SA6.P$2 SA6.P$1 23.5,42 | C5.1 23.5,42 | 23.5,42 R17.2
N$18
  Bottom 0.508: R36.1 107.89,71.86 109.5,70.25 109.5,59.5 110.16,58.84 VT11.2
N$19
  Bottom 1.27: LED2.A 173.72,21.5 173.33,21.11 R14.1
N$20
  Bottom 0.508: VT5.1 110.64,20.61 110.64,15.04 111.42,14.25 115.92,14.25 119.17,17.5 119.17,18.25 R4.1 119.92,18.5 120.21,18.21
  Bottom 1.27: VT2.1 122.37,16.05 120.21,18.21 119.21,18.21 119.17,18.25
N$21
  Bottom 0.508: R16.3 7,3.75 131.58,3.75 132.25,4.42 R13.1
N$22
  Bottom 1.27: R39.1 173.51,77.45 LED3.A
N$23
  Bottom 0.508: 6,10 11,5 115.5,5 120,9.5 120,10.75 122.23,12.98 130.27,12.98 130.5,12.75
  Bottom 1.27: R16.2 6,10 | DA3.1 138.2,7.5 134.45,11.25 132,11.25 130.5,12.75
N$24  (via drill 0.8 pad 1.6)
  Top 0.508: v33.5,56 v77.25,56 | v120.25,86.5 v89.5,86.5
  Bottom 0.508: R45.2 11,70 11,67.75 22.75,56 v33.5,56 | v77.25,56 77.5,56.25 86.5,56.25 89,58.75 89,82 87.25,83.75 87.25,85.5 88.25,86.5 v89.5,86.5 | v120.25,86.5 121,87.25 121,91.5 123,93.5 129.25,93.5 130,94.25 130,95 131,96 133.75,96 134.7,95.05
  Bottom 1.27: DA4.1 150.89,94.56 150.4,95.05 134.7,95.05
N$25
  Bottom 1.27: D9.C 191.83,90.33 190.6,89.1 VT13.3 190.73,81.35 R37.1 202.26,69.51 R37.3 202.26,68.51 202.25,68.5
N$26
  Bottom 0.508: R27.1 216,13.83 216,16 216.75,16.75 216.75,19.25 216.13,19.86 IC1.6 211.87,19.86 211.08,19.08 R26.2
N$27
  Bottom 0.508: R28.2 222.92,21.92 222.13,21.14 IC1.2 218.37,21.14 218,21.5 218,22.75 216,24.75 216,26.67 R29.1
N$28
  Bottom 0.508: R88.2 33.33,90.42 31,92.75 25.25,92.75 23.5,91 23.5,88
  Bottom 1.27: SA11.P$2 SA11.P$1 23.5,82.55 23.5,88 | 23.5,88 C9.1 | 23.5,88 R47.2
N$29  (via drill 0.8 pad 1.6)
  Top 0.508: v33.5,52 v77.25,52 | v124,54.5 v96,54.5
  Bottom 0.508: R46.2 9,52 v33.5,52 | v77.25,52 87,52 88.25,53.25 94.75,53.25 v96,54.5
  Bottom 1.27: DA5.1 139.18,58.74 138.28,57.54 134.98,60.84 131.34,60.84 125,54.5 v124,54.5
N$30
  Bottom 1.27: LED4.A 174.01,71.8 R41.1
N$31
  Bottom 0.508: VT12.1 114.02,72.75 112.39,71.12 111.38,71.12 110.75,70.5 110.75,65.25 111.5,64.5 116,64.5 121.7,70.2 121.5,70.4 121.5,72 120.5,73 R31.1 | 123.69,70.81 VT9.1
  Bottom 1.27: VT9.1 121.7,70.2
N$32
  Bottom 0.508: SA16.P$2 21.5,119.5 9.75,119.5 7,122.25 4.25,122.25 3.75,121.75 3.75,111.11 8.25,106.61 8.25,104 6.5,102.25 4.5,102.25 3.5,101.25 3.5,93.25 4.5,92.25 7.25,92.25 13,98 13,101 16,104 20,104 20.9,103.1 C13.1 23.5,101.75 | R74.2 23.5,101.75 | R89.2 24.25,94.25 23.5,95 23.5,101.75
  Bottom 1.27: SA16.P$1 SA16.P$2
N$33
  Bottom 0.508: R57.1 215.58,70.08 217,71.5 217,73.75 216.38,74.36 IC2.6 212.25,74.36 211.21,73.33 R56.2
N$34
  Bottom 0.508: R58.2 225.5,76.5 | 225.5,76.5 225.5,78.5 222.75,81.25 R59.1 | IC2.2 223.13,75.64 224,76.5 225.5,76.5
N$35
  Bottom 0.2: JP2.4 35.56,106.87 37.25,106.87
  Bottom 1.27: DD1.P$4 37.25,106.87 36.12,106.87
N$36
  Bottom 1.27: XS4.1 241.4,72.5 | 241.4,72.5 237.4,68.5 237.4,64.65 234.75,62 196.75,62 | 196.75,62 194.75,62 192.5,59.75 D10.C | VT14.3 195.03,67.22 196.75,65.5 196.75,62 | XS3.P$1 241.4,73.65 241.4,72.5
N$37  (via drill 0.8 pad 1.6)
  Top 1.27: v232.75,64.5 242.25,64.5 v242.5,64.25
  Bottom 1.27: v242.5,64.25 SA10.1$P | v232.75,64.5 R37.4 232.75,73.75
N$38
  Bottom 1.27: SA8.1$P 242.5,82.75 241,81.25 232.84,81.25 R37.2 232.75,76
N$39
  Bottom 1.27: SA8.1$S 246.75,88.25 246.75,77.5 | 246.75,77.5 246.75,62.25 SA10.1$S | 246.75,77.5 XS4.2 242.65,76.25 XS3.P$2
N$40
  Bottom 0.508: R48.1 173,93.83 175.08,91.75 179.5,91.75 180.75,93 182.5,93 184,91.5 184,89.62 180.12,85.75
  Bottom 1.27: VT13.1 183.3,80.2 180.12,83.38 180.12,85.5 | 180.12,85.5 180.12,85.75 | R52.2 180.12,85.5
N$41
  Bottom 0.508: 177.96,64.94 R53.2 | R50.2 173.25,56.17 175,57.92 183.42,57.92 184.25,58.75 184.25,60.5 183.5,61.25 183.5,61.75
  Bottom 1.27: 177.96,64.94 VT14.1 183.5,61.75
N$42  (via drill 0.8 pad 1.6)
  Top 0.508: v33.5,54 v77.25,54 | v120.25,84.25 v89.5,84.25
  Bottom 0.508: R45.3 22,54 v33.5,54 | v77.25,54 86.75,54 90.25,57.5 90.25,83.5 v89.5,84.25 | v120.25,84.25 121.25,84.25 122,85 122,90.5 123.5,92 130.75,92 132.2,93.45 R38.1
N$43  (via drill 0.8 pad 1.6)
  Top 0.508: v33.5,50 v77.25,50 | v119.25,51.75 v96,51.75
  Bottom 0.508: R46.3 v33.5,50 | v77.25,50 87.25,50 89,51.75 v96,51.75 | v119.25,51.75 120,51 129.75,51 132.25,53.5 R40.1
N$44
  Bottom 0.508: 109.25,96.5 110.75,98 112.5,98 113.75,96.75 113.75,94.5 108.6,89.35 C10.1 | SA9.1$P 109.25,96.5 | SA7.1$S 100.5,96.75 101.75,98 107.75,98 109.25,96.5
N$45
  Bottom 0.2: JP2.3 35.56,104.33 38.5,104.33
  Bottom 1.27: DD1.P$5 38.5,104.33 36.12,104.33
N$46
  Bottom 0.508: VT11.1 111.48,61.98 112.25,62.75 116,62.75 117.25,61.5 117.25,58 115.25,56 107.5,56 106.28,57.22 R32.1 D6.A 103.41,61.09 101,63.5 101,77.75 102.29,79.04 R33.1 109.25,79.04 110.25,80.04 113.46,80.04 116.64,76.86 116.64,69.89 114.5,67.75 VT10.2
N$47
  Bottom 0.508: VT12.2 106.33,75.41 D8.A 104.7,75.45 103.25,74 103.25,69.8 104.78,68.27 D7.A R34.1
N$48
  Bottom 0.2: JP2.2 35.56,101.79 36.75,101.79
  Bottom 1.27: DD1.P$6 36.75,101.79 36.12,101.79
N$49
  Bottom 0.2: JP2.1 35.56,99.25 36.12,99.25
  Bottom 1.27: 36.12,99.25 DD1.P$7
N$50  (via drill 3 pad 2.3)
  other vias: 215,115
N$51  (via drill 0.8 pad 1.6)
  Top 0.508: v119.5,124.75 v131.75,124.75
  Bottom 0.508: VT17.1 112.5,119 113.25,118.25 115.5,118.25 118,120.75 118,124.75 | 119.5,131.25 R60.1 118.75,131.25 118,130.5 118,124.75 | 118,124.75 v119.5,124.75 | v131.75,124.75 131.5,125 131.5,132.25 129.5,134.25
  Bottom 1.27: VT15.1 129.5,134.25
N$52  (via drill 2.3 pad 3)
  other vias: 215,35
N$53
  Bottom 0.508: R66.1 108.14,124.61 109.75,123 109.75,112.5 110.5,111.75 112.66,111.75 VT18.2
N$54
  Bottom 1.27: LED5.A 174.11,129 173.16,128.5 R69.1
N$55  (via drill 0.8 pad 1.6)
  Top 0.508: v54.75,128 v69.5,128 | v129.75,141.25 v116.75,141.25
  Bottom 0.508: R72.2 7.5,118.25 23.4,118.25 33.15,128 v54.75,128 | v69.5,128 78.55,128 93.55,143 115,143 v116.75,141.25 | v129.75,141.25 129.75,144.5 129.8,144.5 131.8,146.5 150.5,146.5 150.89,146.11 150.89,144.8
  Bottom 1.27: DA6.1 150.89,144.8
N$56
  Bottom 1.27: VT20.3 189,136.42 189,139.5 191.25,141.75 D14.C 196.36,141.75 R67.1 202.26,135.68 202.44,135.5 202.44,123.5 202.26,123.32 R67.3
N$57  (via drill 0.8 pad 1.6)
  Top 0.508: v69.5,120 v54.75,120
  Bottom 0.508: R73.2 7.25,100 23,115.75 24.75,115.75 33.3,124.3 50.45,124.3 v54.75,120 | v69.5,120 79,120 93,106 126.25,106 132,111.75
  Bottom 1.27: DA7.1 135.8,109.98 134.03,111.75 132,111.75
N$58
  Bottom 1.27: R71.1 173.41,123.35 175.48,123.35 LED6.A
N$59
  Bottom 0.508: VT19.1 111,123.23 111,118 112,117 116.25,117 122.25,123 122.25,125.11
  Bottom 1.27: 122.25,123 122.25,124.99 VT16.1 122.25,125.11 122.25,126.25 120.75,127.75 R61.1
N$60
  Bottom 1.27: VT7.3 190.58,13.83 190.58,9 D5.C 233.33,7 239.25,12.92 239.25,18.05 243.7,22.5 | XS2.1 243.7,22.5 | 243.7,22.5 242.5,23.7 XS1.P$1
N$61  (via drill 2.3 pad 3)
  other vias: 35,114.9
N$62
  Bottom 2.54: J1.1 15.6,142.75 18.39,139.96 F1.1
N$63
  Bottom 1.27: SA5.1$S 244.95,7.5 247,9.55 247,27.75 | SA3.1$S 247,40.5 247,27.75 | 247,27.75 245.2,27.75 XS2.2 243.75,27.5 XS1.P$2
N$64
  Bottom 0.508: R84.1 221.92,135.75 223.5,134.17 223.5,131 | IC3.6 222.63,130.13 223.5,131 | 223.5,131 227.17,131 R83.2
N$65
  Bottom 2.54: F1.2 22.41,145.04 25.25,142.2 SA1.3
N$66
  Bottom 0.508: R85.2 210.58,127.83 211.62,128.87 IC3.2 216.5,128.87 217.5,127.86 217.5,126.75 218.92,125.33 R86.1
N$67  (via drill 2.3 pad 3)
  other vias: 35,35
N$68  (via drill 0.8 pad 1.6)
  Top 1.27: v202.75,116.5 v202.75,110.75
  Bottom 1.27: v202.75,110.75 219.35,110.75 224.85,116.25 228,116.25 230.75,113.5 235.1,113.5 236.3,114.7 236.3,120.05 238.5,122.25 241.5,122.25 | 190.58,111 D15.C 190.65,110.93 190.65,113.5 | 190.65,113.5 VT21.3 190.65,115.75 | v202.75,116.5 202,115.75 197,115.75 194.75,113.5 190.65,113.5 | XS6.1 243.85,122.25 241.5,122.25 | XS5.P$1 241.5,122.25
N$69  (via drill 0.8 pad 1.6)
  Top 1.27: v244,116.25 v232.75,116.25
  Bottom 1.27: SA15.1$P 244,110.25 v244,116.25 | v232.75,116.25 v232.74,116.26 R67.4 232.75,128.25
N$70
  Bottom 1.27: SA13.1$P 244.25,137.25 242.85,135.85 R67.2 232.75,130.5
N$71
  Bottom 1.27: SA13.1$S 246.75,129.5 244.75,127.5 XS6.2 | XS6.2 246.75,124.85 SA15.1$S | XS5.P$2 242.75,127.5 XS6.2
N$72  (via drill 0.8 pad 1.6)
  Top 0.508: v175.25,105.5 v175.25,115.75
  Bottom 0.508: R75.1 175.08,105.67 v175.25,105.5 | v175.25,115.75 177.5,115.75 177.7,115.55 | 183.15,127.65 181.38,125.88 181.38,120.38 182.5,119.25 185.25,119.25 185.75,118.75 185.75,115.75 185.25,115.25 178,115.25
  Bottom 1.27: VT20.1 183.15,127.65 | 178,115.25 177.7,115.55 R79.2
N$73
  Bottom 0.508: R77.2 173.33,143.75 182.25,143.75 183.25,142.75 183.25,140.5 182.25,139.5 179,139.5 177.6,138.1 R80.2 179.99,133.11 179.99,118.51
  Bottom 1.27: VT21.1 181.31,117.19 179.99,118.51
N$74  (via drill 0.8 pad 1.6)
  Top 0.508: v54.75,126 v69.5,126 | v129.75,136.25 v116.75,136.25
  Bottom 0.508: R72.3 7.75,117 24.1,117 33.1,126 v54.75,126 | v69.5,126 79.35,126 95.35,142 113.5,142 116.75,138.75 v116.75,136.25 | R68.1 130.19,136.25 v129.75,136.25
N$75  (via drill 0.8 pad 1.6)
  Top 0.508: v69.5,117.75 v54.75,117.75
  Bottom 0.508: R73.3 7,95 10.75,98.75 10.75,100.75 24.5,114.5 25.3,114.5 33.55,122.75 48.45,122.75 53.45,117.75 v54.75,117.75 | v69.5,117.75 79.25,117.75 92.25,104.75 127.83,104.75 R70.1
N$76
  Bottom 0.508: SA14.1$P 107.25,137 103.25,137 | SA12.1$S 102.5,137 103.25,137 | C14.1 103.25,137
N$78
  Bottom 0.508: VT18.1 111.48,114.73 112.5,115.75 115,115.75 116.5,114.25 116.5,110.75 113,107.25 110.91,107.25 107.91,110.25 R62.1 D11.A 106.41,114 102.75,114 101.25,115.5 101.25,131.5 101.54,131.79 R63.1 108.16,133.54 113.32,133.54 116.86,130 116.86,122.83 VT17.2
N$79
  Bottom 0.508: R64.1 D12.A 104.98,121.02 103.49,122.51 103.49,126.49 105.2,128.2 D13.A 112.71,128.2 VT19.2
N$84
  Bottom 1.27: R19.1 R21.2
N$87
  Bottom 1.27: R49.1 R51.2
N$89
  Bottom 0.508: SA4.1$P 109.25,46.25 | C6.1 108.6,38.1 113.75,43.25 113.75,45.25 112.75,46.25 109.25,46.25 | SA2.1$S 103.55,44.3 105.5,46.25 109.25,46.25
N$92
  Bottom 0.508: R78.2 29.5,97.5 31,99 31,105.75 29.5,107.25 R76.1
N$95
  Bottom 0.508: HG1.P$4 44.71,27.46 48,30.75 48,48.25 40.25,56 40.25,72.75 43.85,76.35 45.84,76.35 DD1.P$16
N$96
  Bottom 0.508: HG1.P$5 44.67,24.92 49.25,29.5 49.25,48.75 41.39,56.61 41.39,71.75 43.45,73.81 45.84,73.81 DD1.P$17
POWER-CTRL-A
  Bottom 0.508: D1.C 97.42,12.39 97.42,16.97 D2.C 93.25,21.14 93.25,42.5 92.5,43.25 91.75,43.25 | 91.75,43.25 75.5,43.25 67,51.75 67,60.5 71,64.5 71,98.5 70.25,99.25 | R44.2 91.75,43.25 | S1.1 69.71,99.79 70.25,99.25 | 70.25,99.25 DD1.P$27
POWER-CTRL-B
  Bottom 0.508: D6.C 97.75,62.72 97.75,66.64 D7.C 92,72.39 92,91.75 90.5,93.25 88.25,93.25 87.5,92.5 75.75,92.5 75,93.25 75,97.75 76.5,99.25 80.5,99.25 81.25,100 81.25,101.75 | 81.25,101.75 81.25,106.75 80.25,107.75 78,107.75 77.25,107 77.25,105 75.75,103.5 73,103.5 72.25,104.25 S1.2 72.25,109.44 71.84,109.84 69.16,109.84 65.78,106.47 65.78,103.78 63.75,101.75 61.16,101.75 DD1.P$26 | R43.2 81.25,101.75
POWER-CTRL-C  (via drill 0.8 pad 1.6)
  Top 0.508: v86,122 v86,105.25
  Bottom 0.508: D11.C 98.25,115.84 98.25,119.02 D12.C 86.98,121.02 v86,122 | v86,105.25 R42.2 82.67,107.58 80.75,109.5 75.57,109.5 74.79,108.72 S1.3 74.79,109.94 73.54,111.19 68.69,111.19 64.5,107 64.5,105.5 63.25,104.25 61.2,104.25 DD1.P$25
PWM-CTRL-A  (via drill 0.8 pad 1.6)
  Top 0.508: v68.75,58.25 v58,58.25 | v54.5,112.25 v54.5,69.25
  Bottom 0.508: v68.75,58.25 68.75,52.3 76.5,44.55 88.25,44.55 89.95,46.25 93.25,46.25 95.2,44.3 SA2.1$O | v58,58.25 58,64.15 54.5,67.65 v54.5,69.25 | v54.5,112.25 54.2,111.95 DD1.P$2
PWM-CTRL-B  (via drill 0.8 pad 1.6)
  Top 0.508: v83.75,94.25 v83.75,86.25 | v75.25,76.25 v66,76.25 | v56.79,112.25 56.75,112.25 v56.75,69.25
  Bottom 0.508: SA7.1$O 85.5,96 v83.75,94.25 | v83.75,86.25 77.25,86.25 75.25,84.25 v75.25,76.25 | v66,76.25 65.5,76.25 64.25,75 64.25,66.25 62.25,64.25 59.75,64.25 56.75,67.25 v56.75,69.25 | v56.79,112.25 53.95,109.41 DD1.P$3
PWM-CTRL-C  (via drill 0.8 pad 1.6)
  Top 0.508: v69.5,123.75 v54.75,123.75
  Bottom 0.508: v69.5,123.75 80.25,123.75 SA12.1$O | v54.75,123.75 56.5,122 56.5,115.75 54.5,113.75 51.25,113.75 50.5,114.5 DD1.P$1
RIGHT-EN
  Bottom 0.508: SA4.1$O 111.75,44 106.28,38.53 R8.1
RIGHT-EN1
  Bottom 0.508: R35.1 106.33,91.08 109.25,94 110.75,94 111.75,95 SA9.1$O
RIGHT-EN2
  Bottom 0.508: R65.1 110.5,135.25 111.75,136.5 SA14.1$O
VCC  (via drill 0.8 pad 1.6)
  Top 0.508: v28.75,99.25 v28.75,91 | v211.5,46.75 v211.5,79.25 | v207.2,115.5 v207.2,83.1 | v208.75,46.75 v208.75,30
  Top 1.27: v56.25,46.25 v42.5,46.25 | v116,38.25 v96.25,38.25 | v103.25,47.16 119.09,47.16 v119.25,47
  Bottom 0.2: 89,32.54 90,31.54 90,31.5
  Bottom 0.508: R49.3 29.75,67.75 36.11,61.39 36.11,50.01 34.1,48 23.25,48 19.27,44.02 19.27,40.1 20.75,38.62 20.75,29.75 22,28.5 26.25,28.5 | R76.3 26.5,112.25 25,110.75 25,106.25 26.5,104.75 27.5,104.75 28.67,103.58 R74.1 28.75,101.67 v28.75,99.25 | v28.75,91 28.75,88.08 R47.1 | IC2.8 213.84,76.91 v211.5,79.25 211.5,81.25 209.55,83.2 207.3,83.2 v207.2,83.1 | v207.2,115.5 207.6,115.5 212.6,120.5 220.75,120.5 221.5,121.25 221.5,125.25 220.1,126.65 IC3.8 | 95,14.75 96.09,14.75 96.12,14.72 R7.2 | v208.75,30 209.75,30 213.9,25.85 213.9,25.16 214.9,24.16 IC1.8
  Bottom 1.27: HG1.P$6 89.17,24.92 89.2,24.95 | 89.2,24.95 90,25.75 90.25,25.5 | HG1.P$9 86.5,32.25 | HG1.P$9 HG1.P$10 58.92,35.08 56.38,37.62 56.38,46.25 v56.25,46.25 54.76,46.25 53.66,47.34 53.66,50.07 45.88,57.85 DD1.P$20 48.13,66.23 49.13,67.23 49.13,73.88 54.25,79 54.25,91.5 50.5,95.25 50.5,100.5 59.41,109.41 DD1.P$23 | 90.25,25.5 90.25,31.25 90,31.5 89,32.5 89,32.54 HG1.P$9 | 89.2,24.95 90.25,23.91 | 90.25,14.75 90.25,23.91 | 90.25,14.75 95,14.75 | R19.3 26.25,23.75 26.25,28.5 26.25,36.34 31.91,42 | 28.75,87.92 R47.1 28.67,84.67 27.75,83.75 R49.3 | v42.5,46.25 36.16,46.25 31.91,42 | v96.25,38.25 96.25,32.63 R8.2 R6.2 99,26.16 99,9.68 96.87,7.55 96.17,7.55 R5.2 95.17,7.5 90.25,12.42 90.25,14.75 | v116,38.25 117.25,39.5 117.25,43 119.25,45 v119.25,47 119.5,46.75 134,46.75 137.45,50.2 168.85,50.2 172.3,46.75 v211.5,46.75 v208.75,46.75 | R17.1 31.91,42 | DA1.2 62.1,141.2 62.1,135.4 61.86,135.16 | R1.2 76.3,132.12 64.9,132.12 | 64.6,132.32 64.5,132.32 | C2.+ 46.5,135.05 61.75,135.05 61.86,135.16 | 64.5,121.75 64.5,110.79 63.12,109.41 DD1.P$23 | S1.4 S1.5 S1.6 68.21,114.31 63.31,109.41 DD1.P$23 | R35.2 96.17,79.08 R33.2 99.25,75.91 99.25,60.5 96.25,57.5 R32.2 | R34.2 94.93,64.68 93.5,63.25 93.5,60.12 R32.2 | R32.2 103.25,50.37 v103.25,47.16 | R65.2 R63.2 99.75,128.28 99.75,113.75 R62.2 93.75,112.75 93.75,114.93 | R64.2 93.75,114.93 | 93.75,114.93 87.57,114.93 80.75,121.75 64.5,121.75 | 90.25,23.91 90.25,25.5 | 64.5,132.32 64.5,121.75 | 61.86,135.16 64.9,132.12 | 64.5,132.32 64.7,132.12 64.9,132.12
VI-LEFT
  Bottom 0.508: 130,27.91 130.08,27.83
  Bottom 1.27: VT1.3 126,32.25 129.7,32.25 | 129.7,32.25 130,32.25 130,27.91 | 129.7,32.25 137.57,40.12 DA2.3 145.81,42.93 147.46,44.58 165.85,44.58 170.25,40.18 R20.1 | R12.2 163.17,30.1 162.47,30.8 137.5,30.8 133.9,27.2 130.71,27.2 130.08,27.83
VI-LEFT1
  Bottom 0.508: 128.15,87.15 130,87.15 130,83.4 131.8,81.6 141.9,81.6 145.25,84.95 163,84.95 | R39.2 163,84.95 | R50.1 173.25,66.5 175.12,68.38 179.62,68.38 180,68.75 180,78.75 176.75,82 173.15,82 170.4,84.75 170.4,87.1 168.9,88.6 167.3,88.6 163.65,84.95 163,84.95
  Bottom 1.27: VT8.3 130,87.15 134.05,91.2 145.65,91.2 DA4.3
VI-LEFT2
  Bottom 0.508: R77.1 171.5,137 169.25,139.25 167,139.25 165,137.25 165,130.75 163,128.75 R69.2
  Bottom 1.27: VT15.3 127.08,139 132.57,139 135.66,142.6 DA6.3 145.81,139.69 148.55,136.95 153.8,136.95 162.3,128.45 R69.2
VI-RIGHT  (via drill 0.8 pad 1.6)
  Top 0.508: v176.5,10.75 v176.5,4.25
  Bottom 1.27: VT2.3 132.25,8.75 136.95,4.05 150.12,4.05 151.19,5.12 151.19,7.37 DA3.3 154.02,7.5 | v176.5,4.25 176.5,4.17 R18.2 171.75,4.17 169.5,6.42 155.1,6.42 154.02,7.5 | v176.5,10.75 173.7,10.75 172.6,11.85 167.45,11.85 163,16.3 163,21.43 R14.2 | 154.02,7.5
VI-RIGHT1
  Bottom 0.508: 181.25,67.75 183.5,67.75 185.5,65.75 185.5,58.25 184,56.75 176.5,56.75 175.62,55.88 175.62,53.88 174.5,52.75 | R48.2 174.67,84 176.25,84 181.25,79 181.25,67.75 | 181.25,67.75 180.31,66.81 176.31,66.81 175.44,65.94 175.44,64.06 174.38,63 172.15,63 170.78,64.38 170.78,68.42 166.55,72.65 R41.2
  Bottom 1.27: VT9.3 125.97,59.4 121.47,54.9 121.47,53.18 122.25,52.4 125.75,52.4 131.6,58.25 134,58.25 137.85,54.4 150.34,54.4 150.89,54.95 DA5.3 151.91,57.72 167.19,57.72 172.17,52.75 174.5,52.75
VI-RIGHT2
  Bottom 0.508: 132.65,114.9 132.65,116.4 130.85,118.2 130.85,120.9 132.25,122.3 132.6,122.3
  Bottom 1.27: VT16.3 120.25,117.75 118.27,115.77 118.27,109.93 119.7,108.5 126.25,108.5 132.65,114.9 134.49,114.9 136.89,117.3 146.78,117.3 150.89,113.19 DA7.3 | R75.2 170.6,113.68 164.9,113.68 163.2,115.38 163.2,122.3 | R71.2 163.25,122.65 163.2,122.6 163.2,122.3 | 132.6,122.3 163.2,122.3
VO-LEFT
  Bottom 1.27: DA2.2 148.55,38.49 148.55,33.15 | 148.55,33.15 166.11,33.15 C3.+ 168.31,35.35 180.32,35.35 D4.A | 148.55,33.15 135.48,33.15 R11.2
VO-LEFT1
  Bottom 1.27: D9.A 181.52,90.75 180.22,89.45 171.81,89.45 170.17,91.09 C7.+ 157.65,91.1 154.07,87.53 148.37,87.53 | 148.37,87.53 148.35,87.55 DA4.2 | R38.2 141.5,84.25 144.78,87.53 148.37,87.53
VO-LEFT2
  Bottom 0.508: R68.2 134.2,145.6 148.05,145.6 148.35,145.3 148.35,144.7
  Bottom 1.27: 181.25,141.75 D14.A 167.29,141.75 C11.+ 158,141.79 155.17,138.96 149.64,138.96 148.35,140.25 DA6.2 148.35,144.7
VO-RIGHT
  Bottom 1.27: D5.A 182.17,6.75 173.55,6.75 171.09,9.21 C4.+ 167.39,8.65 156.3,8.65 153.37,11.58 148.56,11.58 148.56,11.48 | 148.56,11.48 148.56,7.73 DA3.2 | 148.56,11.48 145.94,14.1 132.98,14.1 R13.2
VO-RIGHT1
  Bottom 1.27: 148.35,63 144,63 141.05,65.95 132.37,65.95 R40.2 | 148.35,63 149.3,63 153.36,63 156.65,59.71 C8.+ 168.44,59.75 D10.A | DA5.2 148.35,63
VO-RIGHT2
  Bottom 1.27: DA7.2 148.35,107.4 149.35,106.4 155.2,106.4 159.76,110.96 | D15.A 180.92,110.86 167.4,110.86 C12.+ 159.76,110.96 | R70.2 132.8,119.78 155.53,119.78 160.16,115.16 160.16,111.36 159.76,110.96

## Text on the board
Bottom: GALVANIKA / CUPRUMBERRY / V2.2 | DRAGBERRY / 2021.01